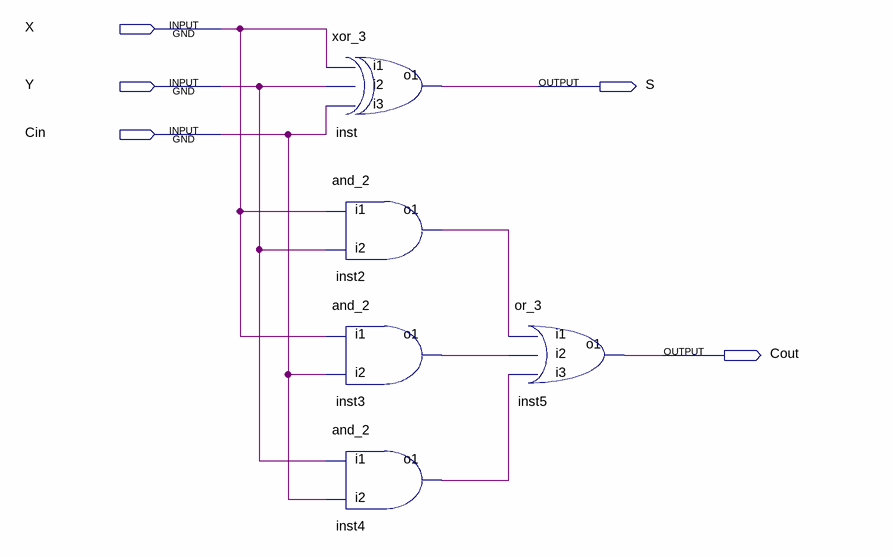
[diagram p0: schematic sheet]
// Quartus schematic FA.bdf as structural Verilog: 5 symbols, 5 pins
module FA (
  input  X,
  input  Y,
  input  Cin,
  output S,
  output Cout
);

  wire inst2_o1, inst3_o1, inst4_o1;

  xor_3 inst (.i1(X), .i2(Y), .i3(Cin), .o1(S));
  and_2 inst2 (.i1(X), .i2(Y), .o1(inst2_o1));
  and_2 inst3 (.i1(X), .i2(Cin), .o1(inst3_o1));
  and_2 inst4 (.i1(Y), .i2(Cin), .o1(inst4_o1));
  or_3 inst5 (.i1(inst2_o1), .i2(inst3_o1), .i3(inst4_o1), .o1(Cout));
endmodule
